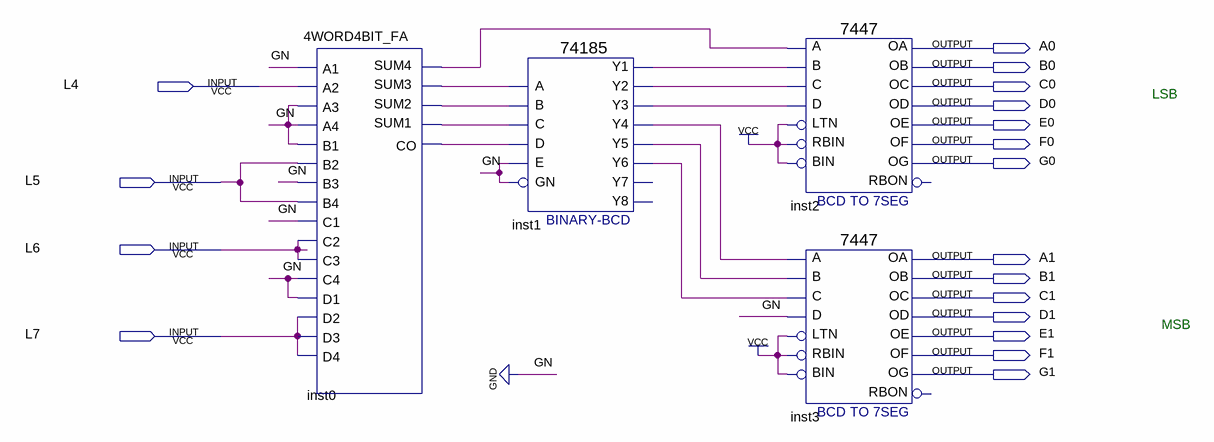
[diagram p0: schematic sheet]
// Quartus schematic DSLAB6_Q2V2.bdf as structural Verilog: 4 symbols, 18 pins
module DSLAB6_Q2V2 (
  input  L4,
  input  L5,
  input  L6,
  input  L7,
  output A0,
  output B0,
  output C0,
  output D0,
  output E0,
  output F0,
  output G0,
  output A1,
  output B1,
  output C1,
  output D1,
  output E1,
  output F1,
  output G1
);

  wire inst0_co, inst0_sum1, inst0_sum2, inst0_sum3, inst0_sum4, inst1_y1, inst1_y2, inst1_y3, inst1_y4,
       inst1_y5, inst1_y6;

  \4WORD4BIT_FA  inst0 (
    .A1(1'b0), .A2(L4), .A3(1'b0), .A4(1'b0), .B1(1'b0), .B2(L5), .B3(1'b0), .B4(L5), .C1(1'b0), .C2(L6),
    .C3(L6), .C4(1'b0), .D1(1'b0), .D2(L7), .D3(L7), .D4(L7), .CO(inst0_co), .SUM1(inst0_sum1),
    .SUM2(inst0_sum2), .SUM3(inst0_sum3), .SUM4(inst0_sum4));
  \74185  inst1 (
    .A(inst0_sum3), .B(inst0_sum2), .D(inst0_co), .C(inst0_sum1), .E(1'b0), .GN(1'b0), .Y1(inst1_y1),
    .Y3(inst1_y3), .Y2(inst1_y2), .Y5(inst1_y5), .Y4(inst1_y4), .Y6(inst1_y6));  // open: Y8, Y7
  \7447  inst2 (
    .LTN(1'b1), .B(inst1_y1), .C(inst1_y2), .D(inst1_y3), .RBIN(1'b1), .BIN(1'b1), .A(inst0_sum4), .OB(B0),
    .OC(C0), .OE(E0), .OD(D0), .OF(F0), .OG(G0), .OA(A0));  // open: RBON
  \7447  inst3 (
    .LTN(1'b1), .B(inst1_y5), .C(inst1_y6), .D(1'b0), .RBIN(1'b1), .BIN(1'b1), .A(inst1_y4), .OB(B1),
    .OC(C1), .OE(E1), .OD(D1), .OF(F1), .OG(G1), .OA(A1));  // open: RBON

  // Notes on the sheet:
  //   LSB
  //   MSB
endmodule
